# Altium schematic sheet Sheet.schdoc (part 2 of 2)
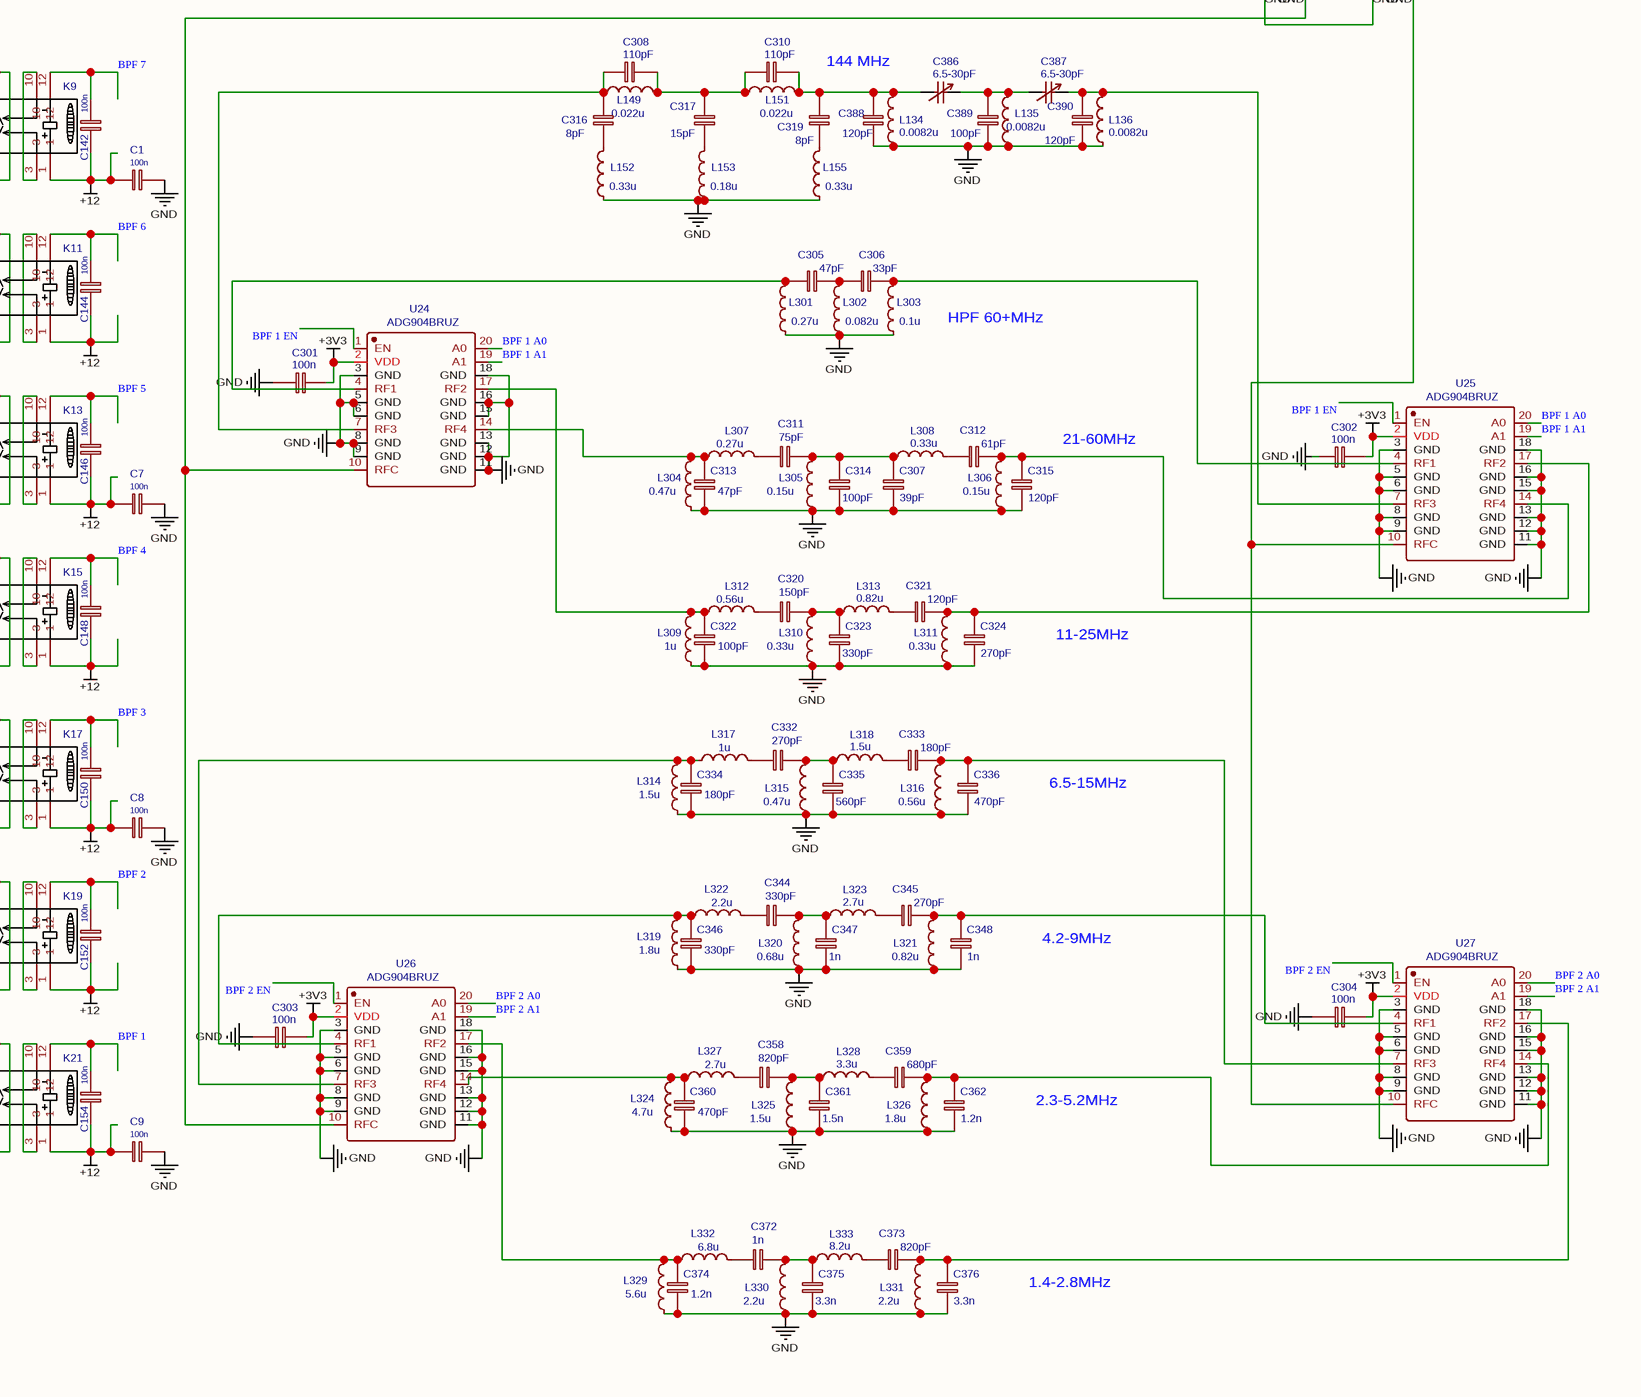
[diagram p6: Sheet.schdoc, bottom right]

## Library data of the parts
C1 C7-C11 C16 C38 C58 C59 C61 C64 C67 C71 C76 C78 C80 C82 C89 C90 C106-C110 C113 C114 C116-C118 C123 C124 C130 C131 C133 C136 C137 C141-C154 C157-C167 C170 C171 C241 C301-C304 = 100n: nameAlias: Value(F); Contributor: LCEDA_Lib; spicePre: C
  C1 C7-C11 C16 C38 C59 C64 C67 C71 C76 C78 C80 C82 C89 C90 C107-C110 C113 C114 C116-C118 C123 C124 C130 C131 C133 C136 C137 C141-C154 C157-C167 C170 C171 C241 C301-C304: spiceSymbolName: C_0805_EU
  C58 C61 C106: spiceSymbolName: C_1206_EU
C2 C3 = 2pF: nameAlias: Value(F); Contributor: LCEDA_Lib; spicePre: C; spiceSymbolName: C_1206_EU
C4-C6 = 5pF: nameAlias: Value(F); Contributor: LCEDA_Lib; spicePre: C; spiceSymbolName: C_1206_EU
C12 C15 = 15+10pF: nameAlias: Value(F); Contributor: LCEDA_Lib; spicePre: C; spiceSymbolName: C_1206_EU
C13 = 10+10pF: nameAlias: Value(F); Contributor: LCEDA_Lib; spicePre: C; spiceSymbolName: C_1206_EU
C14 C17 C19 C20 C72 C87 C91 C93 C103 C314 C322 C389 = 100pF: nameAlias: Value(F); Contributor: LCEDA_Lib; spicePre: C
  C14 C17 C19 C20 C87 C91 C93 C103: spiceSymbolName: C_1206_EU
  C72 C314 C322 C389: spiceSymbolName: C_0805_EU
C18 = 100+22pF: nameAlias: Value(F); Contributor: LCEDA_Lib; spicePre: C; spiceSymbolName: C_1206_EU
C22 C25 C28 C320 = 150pF: nameAlias: Value(F); Contributor: LCEDA_Lib; spicePre: C
  C22 C25 C28: spiceSymbolName: C_1206_EU
  C320: spiceSymbolName: C_0805_EU
C23 C86 C305 C313 = 47pF: nameAlias: Value(F); Contributor: LCEDA_Lib; spicePre: C
  C23 C86: spiceSymbolName: C_1206_EU
  C305 C313: spiceSymbolName: C_0805_EU
C24 C27 C30 C88 = 220pF: nameAlias: Value(F); Contributor: LCEDA_Lib; spicePre: C; spiceSymbolName: C_1206_EU
C29 C323 C344 C346 = 330pF: nameAlias: Value(F); Contributor: LCEDA_Lib; spicePre: C
  C29: spiceSymbolName: C_1206_EU
  C323 C344 C346: spiceSymbolName: C_0805_EU
C32-C35 C336 C360 = 470pF: nameAlias: Value(F); Contributor: LCEDA_Lib; spicePre: C
  C32-C35: spiceSymbolName: C_1206_EU
  C336 C360: spiceSymbolName: C_0805_EU
C37 C41 = 470+330pF: nameAlias: Value(F); Contributor: LCEDA_Lib; spicePre: C; spiceSymbolName: C_1206_EU
C39 C45 = 1000pF: nameAlias: Value(F); Contributor: LCEDA_Lib; spicePre: C; spiceSymbolName: C_1206_EU
C40 C335 = 560pF: nameAlias: Value(F); Contributor: LCEDA_Lib; spicePre: C
  C40: spiceSymbolName: C_1206_EU
  C335: spiceSymbolName: C_0805_EU
C43 C46 = 1000+220pF: nameAlias: Value(F); Contributor: LCEDA_Lib; spicePre: C; spiceSymbolName: C_1206_EU
C44 = 1000+470pF: nameAlias: Value(F); Contributor: LCEDA_Lib; spicePre: C; spiceSymbolName: C_1206_EU
C52 C56 = 100pF 500V: nameAlias: Value(F); Contributor: LCEDA_Lib; spicePre: C; spiceSymbolName: C_1206_EU
C53 C54 C70 C75 = 4.7n: nameAlias: Value(F); Contributor: LCEDA_Lib; spicePre: C
  C53 C54: spiceSymbolName: C_1206_EU
  C70 C75: spiceSymbolName: C_0805_EU
C55 = 27pF: nameAlias: Value(F); Contributor: LCEDA_Lib; spicePre: C; spiceSymbolName: C_0805_EU
C57 = 1.2n 500V: nameAlias: Value(F); Contributor: LCEDA_Lib; spicePre: C; spiceSymbolName: C_1206_EU
C60 = 200p 500V: nameAlias: Value(F); Contributor: LCEDA_Lib; spicePre: C; spiceSymbolName: C_1206_EU
C62 C63 C79 C83 C126 C128 = 1uF: nameAlias: Value(F); Contributor: LCEDA_Lib; spicePre: C; spiceSymbolName: C_0805_EU
C65 C66 C386 C387 = 6.5-30pF: BOM_Manufacturer: Murata Electronics; BOM_Manufacturer Part: TZC3P300A110R00; nameAlias: Value; Contributor: LCSC; BOM_Supplier: LCSC; BOM_Supplier Part: C107707; spicePre: C; spiceSymbolName: TZC3P300A110R00
C68 C73 C315 C321 C388 C390 = 120pF: nameAlias: Value(F); Contributor: LCEDA_Lib; spicePre: C; spiceSymbolName: C_0805_EU
C69 C92 C102 C121 = 10n: nameAlias: Value(F); Contributor: LCEDA_Lib; spicePre: C
  C69 C121: spiceSymbolName: C_0805_EU
  C92 C102: spiceSymbolName: C_1206_EU
C74 C77 = 22uF: nameAlias: Value(F); Contributor: EasyEDA; spicePre: C; spiceSymbolName: Cap_Tantalum(SMD)_B-3528_EU
C81 C111 = 15n: nameAlias: Value(F); Contributor: LCEDA_Lib; spicePre: C; spiceSymbolName: C_1206_EU
C84 = 10pF: nameAlias: Value(F); Contributor: LCEDA_Lib; spicePre: C; spiceSymbolName: C_1206_EU
C85 = 22pF: nameAlias: Value(F); Contributor: LCEDA_Lib; spicePre: C; spiceSymbolName: C_1206_EU
C94 C104 C112 C115 C120 C122 C347 C348 C372 = 1n: nameAlias: Value(F); Contributor: LCEDA_Lib; spicePre: C
  C94 C104: spiceSymbolName: C_1206_EU
  C112 C115 C120 C122 C347 C348 C372: spiceSymbolName: C_0805_EU
C95 = 2.2uF: nameAlias: Value(F); Contributor: LCEDA_Lib; spicePre: C; spiceSymbolName: C_1206_EU
C96-C100 = *: BOM_Manufacturer: TDK; BOM_Manufacturer Part: CC45SL3AD101JYSNA; Contributor: LCSC; BOM_Supplier: LCSC; BOM_Supplier Part: C2835349; spicePre: C; spiceSymbolName: CC45SL3AD101JYSNA
C101 = 200pF: nameAlias: Value(F); Contributor: LCEDA_Lib; spicePre: C; spiceSymbolName: C_1206_EU
C105 = 1n8: nameAlias: Value(F); Contributor: LCEDA_Lib; spicePre: C; spiceSymbolName: C_1206_EU
C119 = 47uF: nameAlias: Value(F); Contributor: EasyEDA; spicePre: C; spiceSymbolName: Cap_Tantalum(SMD)_B-3528_EU
C127 C132 = 100p: nameAlias: Value(F); Contributor: LCEDA_Lib; spicePre: C; spiceSymbolName: C_0805_EU
C129 = 10uF 25V: nameAlias: Value(F); Contributor: LCEDA_Lib; spicePre: C; spiceSymbolName: CE_SMD_D4.0×H5.5_EU
C201 = 39p: nameAlias: Value(F); Contributor: LCEDA_Lib; spicePre: C; spiceSymbolName: C_0805_EU
C202 C208 = 68p: nameAlias: Value(F); Contributor: LCEDA_Lib; spicePre: C; spiceSymbolName: C_0805_EU
C203 = 12p: nameAlias: Value(F); Contributor: LCEDA_Lib; spicePre: C; spiceSymbolName: C_0805_EU
C204 = 27p: nameAlias: Value(F); Contributor: LCEDA_Lib; spicePre: C; spiceSymbolName: C_0805_EU
C207 = 51p: nameAlias: Value(F); Contributor: LCEDA_Lib; spicePre: C; spiceSymbolName: C_0805_EU
C210 = 47p: nameAlias: Value(F); Contributor: LCEDA_Lib; spicePre: C; spiceSymbolName: C_0805_EU
C306 = 33pF: nameAlias: Value(F); Contributor: LCEDA_Lib; spicePre: C; spiceSymbolName: C_0805_EU
C307 = 39pF: nameAlias: Value(F); Contributor: LCEDA_Lib; spicePre: C; spiceSymbolName: C_0805_EU
C308 C310 = 110pF: nameAlias: Value(F); Contributor: LCEDA_Lib; spicePre: C; spiceSymbolName: C_0805_EU
C311 = 75pF: nameAlias: Value(F); Contributor: LCEDA_Lib; spicePre: C; spiceSymbolName: C_0805_EU
C312 = 61pF: nameAlias: Value(F); Contributor: LCEDA_Lib; spicePre: C; spiceSymbolName: C_0805_EU
C316 C319 = 8pF: nameAlias: Value(F); Contributor: LCEDA_Lib; spicePre: C; spiceSymbolName: C_0805_EU
C317 = 15pF: nameAlias: Value(F); Contributor: LCEDA_Lib; spicePre: C; spiceSymbolName: C_0805_EU
C324 C332 C345 = 270pF: nameAlias: Value(F); Contributor: LCEDA_Lib; spicePre: C; spiceSymbolName: C_0805_EU
C333 C334 = 180pF: nameAlias: Value(F); Contributor: LCEDA_Lib; spicePre: C; spiceSymbolName: C_0805_EU
C358 C373 = 820pF: nameAlias: Value(F); Contributor: LCEDA_Lib; spicePre: C; spiceSymbolName: C_0805_EU
C359 = 680pF: nameAlias: Value(F); Contributor: LCEDA_Lib; spicePre: C; spiceSymbolName: C_0805_EU
C361 = 1.5n: nameAlias: Value(F); Contributor: LCEDA_Lib; spicePre: C; spiceSymbolName: C_0805_EU
C362 C374 = 1.2n: nameAlias: Value(F); Contributor: LCEDA_Lib; spicePre: C; spiceSymbolName: C_0805_EU
C375 C376 = 3.3n: nameAlias: Value(F); Contributor: LCEDA_Lib; spicePre: C; spiceSymbolName: C_0805_EU
D1 D3 D49 D50 = BAT46JFILM: BOM_Manufacturer: STMicroelectronics; Contributor: LCSC; BOM_Supplier: LCSC; BOM_Supplier Part: C111205; BOM_Manufacturer Part: BAT46JFILM; BOM_JLCPCB Part Class: Extended Part; spicePre: D; spiceSymbolName: BAT46JFILM
D2 = SMAJ5.0A-TR: BOM_Manufacturer: STMicroelectronics; Contributor: LCSC; BOM_Supplier: LCSC; BOM_Supplier Part: C98802; BOM_Manufacturer Part: SMAJ5.0A-TR; BOM_JLCPCB Part Class: Extended Part; spicePre: D; spiceSymbolName: SMAJ5.0A-TR
D4 D5 D8 D9 D13 D15 D17 D20 D22 D25 D27 D31 D32 D38-D48 D51 = 1N4148W: BOM_Manufacturer: Tak Cheong; Contributor: LCEDA_Lib; BOM_Supplier: LCSC; BOM_Manufacturer Part: 1N4148W; BOM_Supplier Part: C129216; spicePre: D; spiceSymbolName: 1N4148W
D7 = BAV99: BOM_Manufacturer: DIODES; BOM_Manufacturer Part: BAV99-7-F; BOM_Supplier: LCSC; BOM_Supplier Part: C106919; BOM_JLCPCB Part Class: Extended Part; spicePre: D; spiceSymbolName: BAV99-7-F
D18 D23 D35-D37 = SS14: BOM_Manufacturer: MDD; BOM_Supplier: LCSC; BOM_Manufacturer Part: SS14; BOM_Supplier Part: C2480; BOM_JLCPCB Part Class: Basic Part; spicePre: D; spiceSymbolName: SS14
FB1 FB2 = BLM21: Contributor: Tommy H; spicePre: L; spiceSymbolName: IND_FERRITE_BEAD
H1 = FAN_OUT: Contributor: LCEDA_Lib; BOM_Supplier Part: C49661; BOM_Supplier: LCSC; spicePre: H; spiceSymbolName: HDR-F-2.54_1x2
J1 = ANT1: BOM_Manufacturer: DreamLNK; BOM_Manufacturer Part: SMA-KE-P901; Contributor: LCSC; BOM_Supplier: LCSC; BOM_Supplier Part: C914556; BOM_JLCPCB Part Class: Extended Part; spicePre: R; spiceSymbolName: SMA-KE-P901
J2 = ADC: BOM_Manufacturer: DreamLNK; BOM_Manufacturer Part: SMA-KE-P901; Contributor: LCSC; BOM_Supplier: LCSC; BOM_Supplier Part: C914556; BOM_JLCPCB Part Class: Extended Part; spicePre: R; spiceSymbolName: SMA-KE-P901
J3 = EXTERNAL: description: HARTING; timeStamp: 1471955319; spicePre: C; spiceSymbolName: IDC10
J4 = MOTHERBOARD: description: HARTING; timeStamp: 1471955319; spicePre: C; spiceSymbolName: IDC10
J5 = ANT2: BOM_Manufacturer: DreamLNK; BOM_Manufacturer Part: SMA-KE-P901; Contributor: LCSC; BOM_Supplier: LCSC; BOM_Supplier Part: C914556; BOM_JLCPCB Part Class: Extended Part; spicePre: R; spiceSymbolName: SMA-KE-P901
J6 = HiCurrent 13.8V: BOM_Manufacturer: Toponelec(拓宜); BOM_Manufacturer Part: TY500-5.08-02P-14-00AH; Contributor: LCSC; BOM_Supplier: LCSC; BOM_Supplier Part: C2828268; BOM_JLCPCB Part Class: Extended Part; spicePre: C; spiceSymbolName: TY500-5.08-02P-14-00AH
J7 = HiCurrent13.8V: BOM_Manufacturer: Toponelec(拓宜); BOM_Manufacturer Part: TY500-5.08-02P-14-00AH; Contributor: LCSC; BOM_Supplier: LCSC; BOM_Supplier Part: C2828268; BOM_JLCPCB Part Class: Extended Part; spicePre: C; spiceSymbolName: TY500-5.08-02P-14-00AH
J8 = 13.8V: BOM_Manufacturer: Toponelec(拓宜); BOM_Manufacturer Part: TY500-5.08-02P-14-00AH; Contributor: LCSC; BOM_Supplier: LCSC; BOM_Supplier Part: C2828268; BOM_JLCPCB Part Class: Extended Part; spicePre: C; spiceSymbolName: TY500-5.08-02P-14-00AH
J9 = DAC: BOM_Manufacturer: DreamLNK; BOM_Manufacturer Part: SMA-KE-P901; Contributor: LCSC; Package Display: No; BOM_Supplier: LCSC; BOM_Supplier Part: C914556; BOM_JLCPCB Part Class: Extended Part; spicePre: R; spiceSymbolName: SMA-KE-P901
K1 K2 K4 K8-K21 K24-K35 = G6S-2-12V: BOM_Manufacturer: OMRON; BOM_Supplier: LCSC; BOM_Manufacturer Part: G6S-2-12V; BOM_Supplier Part: C28410; BOM_JLCPCB Part Class: Extended Part; spicePre: K; spiceSymbolName: G6S-2-12V
K50 = G6K-2F-5V: BOM_Manufacturer: Omron Electronics; Contributor: LCSC; BOM_Supplier: LCSC; BOM_Supplier Part: C231389; BOM_Manufacturer Part: -; spicePre: K; spiceSymbolName: G6K-2F-Y DC5
L1-L3 = 0.2uH: BOM_Manufacturer: China; BOM_Manufacturer Part: BL02RN2R1M2; nameAlias: Value(H); Value: 7A; Contributor: Константин Сергеевич; BOM_Supplier Part: C84974; spicePre: L; spiceSymbolName: T68-2 Iron Powder Toroidal Inductor
L7 L8 = 0.065uH: BOM_Manufacturer: China; BOM_Manufacturer Part: BL02RN2R1M2; nameAlias: Value(H); Value: 7A; Contributor: Константин Сергеевич; BOM_Supplier Part: C84974; spicePre: L; spiceSymbolName: T68-2 Iron Powder Toroidal Inductor
L10 L11 = 0.15uH: BOM_Manufacturer: China; BOM_Manufacturer Part: BL02RN2R1M2; nameAlias: Value(H); Value: 7A; Contributor: Константин Сергеевич; BOM_Supplier Part: C84974; spicePre: L; spiceSymbolName: T68-2 Iron Powder Toroidal Inductor
L13 L14 = 0.3uH: BOM_Manufacturer: China; BOM_Manufacturer Part: BL02RN2R1M2; nameAlias: Value(H); Value: 7A; Contributor: Константин Сергеевич; BOM_Supplier Part: C84974; spicePre: L; spiceSymbolName: T68-2 Iron Powder Toroidal Inductor
L16 L17 = 0.6uH: BOM_Manufacturer: China; BOM_Manufacturer Part: BL02RN2R1M2; nameAlias: Value(H); Value: 7A; Contributor: Константин Сергеевич; BOM_Supplier Part: C84974; spicePre: L; spiceSymbolName: T68-2 Iron Powder Toroidal Inductor
L19 L20 = 1.15uH: BOM_Manufacturer: China; BOM_Manufacturer Part: BL02RN2R1M2; nameAlias: Value(H); Value: 7A; Contributor: Константин Сергеевич; BOM_Supplier Part: C84974; spicePre: L; spiceSymbolName: T68-2 Iron Powder Toroidal Inductor
L22 L23 = 2.3uH: BOM_Manufacturer: China; BOM_Manufacturer Part: BL02RN2R1M2; nameAlias: Value(H); Value: 7A; Contributor: Константин Сергеевич; BOM_Supplier Part: C84974; spicePre: L; spiceSymbolName: T68-2 Iron Powder Toroidal Inductor
L25 L26 = 4.5uH: BOM_Manufacturer: China; BOM_Manufacturer Part: BL02RN2R1M2; nameAlias: Value(H); Value: 7A; Contributor: Константин Сергеевич; BOM_Supplier Part: C84974; spicePre: L; spiceSymbolName: T68-2 Iron Powder Toroidal Inductor
L30 L43 = 10u 10x10: Contributor: Esteban Benito; spicePre: L; spiceSymbolName: IND_FERRITE_CORE
L31 L46 = 0.22u: nameAlias: Value(H); Contributor: LCEDA_Lib; spicePre: L; spiceSymbolName: L0805_US
L32-L34 = 0.0082u: nameAlias: Value(H); Contributor: LCEDA_Lib; spicePre: L; spiceSymbolName: L0805_US
L35 = 0.1uH: BOM_Manufacturer: China; BOM_Manufacturer Part: BL02RN2R1M2; nameAlias: Value(H); Value: 7A; Contributor: Константин Сергеевич; BOM_Supplier Part: C84974; spicePre: L; spiceSymbolName: T68-2 Iron Powder Toroidal Inductor
L36 = 0.22uH: BOM_Manufacturer: China; BOM_Manufacturer Part: BL02RN2R1M2; nameAlias: Value(H); Value: 7A; Contributor: Константин Сергеевич; BOM_Supplier Part: C84974; spicePre: L; spiceSymbolName: T68-2 Iron Powder Toroidal Inductor
L39 = 0.45uH: BOM_Manufacturer: China; BOM_Manufacturer Part: BL02RN2R1M2; nameAlias: Value(H); Value: 7A; Contributor: Константин Сергеевич; BOM_Supplier Part: C84974; spicePre: L; spiceSymbolName: T68-2 Iron Powder Toroidal Inductor
L41 = 1.0uH: BOM_Manufacturer: China; BOM_Manufacturer Part: BL02RN2R1M2; nameAlias: Value(H); Value: 7A; Contributor: Константин Сергеевич; BOM_Supplier Part: C84974; spicePre: L; spiceSymbolName: T68-2 Iron Powder Toroidal Inductor
L42 = 2.2uH: BOM_Manufacturer: China; BOM_Manufacturer Part: BL02RN2R1M2; nameAlias: Value(H); Value: 7A; Contributor: Константин Сергеевич; BOM_Supplier Part: C84974; spicePre: L; spiceSymbolName: T68-2 Iron Powder Toroidal Inductor
L48 = 0.022u: nameAlias: Value(H); Contributor: LCEDA_Lib; spicePre: L; spiceSymbolName: L0805_US
L134-L136 = 0.0082u: BOM_Manufacturer: KEMET; BOM_Manufacturer Part: L0805C100MDWIT; Contributor: Константин Тищенко; BOM_Supplier: LCSC; BOM_Supplier Part: C696787; spicePre: L; spiceSymbolName: L0805-WOLF
L140 = 0.1u: nameAlias: Value(H); Contributor: LCEDA_Lib; spicePre: L; spiceSymbolName: L0805_US
L141 = 0.082u: nameAlias: Value(H); Contributor: LCEDA_Lib; spicePre: L; spiceSymbolName: L0805_US
L142 = 0.15u: nameAlias: Value(H); Contributor: LCEDA_Lib; spicePre: L; spiceSymbolName: L0805_US
L149 L151 = 0.022u: BOM_Manufacturer: KEMET; BOM_Manufacturer Part: L0805C100MDWIT; Contributor: Константин Тищенко; BOM_Supplier: LCSC; BOM_Supplier Part: C696787; spicePre: L; spiceSymbolName: L0805-WOLF
L152 L155 L308 L310 L311 = 0.33u: BOM_Manufacturer: KEMET; BOM_Manufacturer Part: L0805C100MDWIT; Contributor: Константин Тищенко; BOM_Supplier: LCSC; BOM_Supplier Part: C696787; spicePre: L; spiceSymbolName: L0805-WOLF
L153 = 0.18u: BOM_Manufacturer: KEMET; BOM_Manufacturer Part: L0805C100MDWIT; Contributor: Константин Тищенко; BOM_Supplier: LCSC; BOM_Supplier Part: C696787; spicePre: L; spiceSymbolName: L0805-WOLF
L301 L307 = 0.27u: BOM_Manufacturer: KEMET; BOM_Manufacturer Part: L0805C100MDWIT; Contributor: Константин Тищенко; BOM_Supplier: LCSC; BOM_Supplier Part: C696787; spicePre: L; spiceSymbolName: L0805-WOLF
L302 = 0.082u: BOM_Manufacturer: KEMET; BOM_Manufacturer Part: L0805C100MDWIT; Contributor: Константин Тищенко; BOM_Supplier: LCSC; BOM_Supplier Part: C696787; spicePre: L; spiceSymbolName: L0805-WOLF
L303 = 0.1u: BOM_Manufacturer: KEMET; BOM_Manufacturer Part: L0805C100MDWIT; Contributor: Константин Тищенко; BOM_Supplier: LCSC; BOM_Supplier Part: C696787; spicePre: L; spiceSymbolName: L0805-WOLF
L304 L315 = 0.47u: BOM_Manufacturer: KEMET; BOM_Manufacturer Part: L0805C100MDWIT; Contributor: Константин Тищенко; BOM_Supplier: LCSC; BOM_Supplier Part: C696787; spicePre: L; spiceSymbolName: L0805-WOLF
L305 L306 = 0.15u: BOM_Manufacturer: KEMET; BOM_Manufacturer Part: L0805C100MDWIT; Contributor: Константин Тищенко; BOM_Supplier: LCSC; BOM_Supplier Part: C696787; spicePre: L; spiceSymbolName: L0805-WOLF
L309 L317 = 1u: BOM_Manufacturer: KEMET; BOM_Manufacturer Part: L0805C100MDWIT; Contributor: Константин Тищенко; BOM_Supplier: LCSC; BOM_Supplier Part: C696787; spicePre: L; spiceSymbolName: L0805-WOLF
L312 L316 = 0.56u: BOM_Manufacturer: KEMET; BOM_Manufacturer Part: L0805C100MDWIT; Contributor: Константин Тищенко; BOM_Supplier: LCSC; BOM_Supplier Part: C696787; spicePre: L; spiceSymbolName: L0805-WOLF
L313 L321 = 0.82u: BOM_Manufacturer: KEMET; BOM_Manufacturer Part: L0805C100MDWIT; Contributor: Константин Тищенко; BOM_Supplier: LCSC; BOM_Supplier Part: C696787; spicePre: L; spiceSymbolName: L0805-WOLF
L314 L318 L325 = 1.5u: BOM_Manufacturer: KEMET; BOM_Manufacturer Part: L0805C100MDWIT; Contributor: Константин Тищенко; BOM_Supplier: LCSC; BOM_Supplier Part: C696787; spicePre: L; spiceSymbolName: L0805-WOLF
L319 L326 = 1.8u: BOM_Manufacturer: KEMET; BOM_Manufacturer Part: L0805C100MDWIT; Contributor: Константин Тищенко; BOM_Supplier: LCSC; BOM_Supplier Part: C696787; spicePre: L; spiceSymbolName: L0805-WOLF
L320 = 0.68u: BOM_Manufacturer: KEMET; BOM_Manufacturer Part: L0805C100MDWIT; Contributor: Константин Тищенко; BOM_Supplier: LCSC; BOM_Supplier Part: C696787; spicePre: L; spiceSymbolName: L0805-WOLF
L322 L330 L331 = 2.2u: BOM_Manufacturer: KEMET; BOM_Manufacturer Part: L0805C100MDWIT; Contributor: Константин Тищенко; BOM_Supplier: LCSC; BOM_Supplier Part: C696787; spicePre: L; spiceSymbolName: L0805-WOLF
L323 L327 = 2.7u: BOM_Manufacturer: KEMET; BOM_Manufacturer Part: L0805C100MDWIT; Contributor: Константин Тищенко; BOM_Supplier: LCSC; BOM_Supplier Part: C696787; spicePre: L; spiceSymbolName: L0805-WOLF
L324 = 4.7u: BOM_Manufacturer: KEMET; BOM_Manufacturer Part: L0805C100MDWIT; Contributor: Константин Тищенко; BOM_Supplier: LCSC; BOM_Supplier Part: C696787; spicePre: L; spiceSymbolName: L0805-WOLF
L328 = 3.3u: BOM_Manufacturer: KEMET; BOM_Manufacturer Part: L0805C100MDWIT; Contributor: Константин Тищенко; BOM_Supplier: LCSC; BOM_Supplier Part: C696787; spicePre: L; spiceSymbolName: L0805-WOLF
L329 = 5.6u: BOM_Manufacturer: KEMET; BOM_Manufacturer Part: L0805C100MDWIT; Contributor: Константин Тищенко; BOM_Supplier: LCSC; BOM_Supplier Part: C696787; spicePre: L; spiceSymbolName: L0805-WOLF
L332 = 6.8u: BOM_Manufacturer: KEMET; BOM_Manufacturer Part: L0805C100MDWIT; Contributor: Константин Тищенко; BOM_Supplier: LCSC; BOM_Supplier Part: C696787; spicePre: L; spiceSymbolName: L0805-WOLF
L333 = 8.2u: BOM_Manufacturer: KEMET; BOM_Manufacturer Part: L0805C100MDWIT; Contributor: Константин Тищенко; BOM_Supplier: LCSC; BOM_Supplier Part: C696787; spicePre: L; spiceSymbolName: L0805-WOLF
Q1 Q3 = RD16HHF1: Contributor: Eagle; spicePre: Q; spiceSymbolName: RD16HHF1
Q2 Q7 Q10 = IRLML9301: BOM_Manufacturer: VBsemi Elec; BOM_Manufacturer Part: IRLML9301TR; Contributor: LCSC; BOM_Supplier: LCSC; BOM_Supplier Part: C710004; BOM_JLCPCB Part Class: Extended Part; spicePre: Q; spiceSymbolName: IRLML9301TR
Q4 = PGA103+/SPF5189Z: Contributor: radiofannat; spicePre: I; spiceSymbolName: SPF5189Z
Q5 Q6 = RD100HHF1: Contributor: alexei009; spicePre: U; spiceSymbolName: RD100HHF1
Q8 = RA80H1415M1: Contributor: konster13.84; BOM_Manufacturer Part: RA80H1415M1; spicePre: U; spiceSymbolName: RA80H1415M1
Q9 = RD01MUS1: Contributor: Broadcastshop; spicePre: U; spiceSymbolName: RD01MUS1
Q11 = IRLML9301: BOM_Manufacturer: IR; BOM_Manufacturer Part: IRLML9301TRPBF; Contributor: LCSC; BOM_Supplier: LCSC; BOM_Supplier Part: C82056; BOM_JLCPCB Part Class: Extended Part; spicePre: Q; spiceSymbolName: IRLML9301TRPBF
Q12 = BSS123: BOM_Manufacturer: CJ; BOM_Supplier: LCSC; BOM_Manufacturer Part: BSS123; BOM_Supplier Part: C79015; BOM_JLCPCB Part Class: Extended Part; spicePre: Q; spiceSymbolName: BSS123
R1 R2 = 22 2W: BOM_Manufacturer: Chian Chia Elec; nameAlias: Resistance (Ohms); Contributor: LCSC; BOM_Supplier: LCSC; BOM_Supplier Part: C122207; BOM_Manufacturer Part: -; BOM_JLCPCB Part Class: Extended Part; spicePre: R; spiceSymbolName: RI40-1/2W-240KΩ±2% T
R3 R7-R12 = 560: nameAlias: Value(Ω); Contributor: LCEDA_Lib; spicePre: R; spiceSymbolName: R_0805_EU
R4 R41 R45 R48 R75 = 30k: nameAlias: Value(Ω); Contributor: LCEDA_Lib; spicePre: R; spiceSymbolName: R_0805_EU
R5 R6 R31 R33 R35 R42 R43 R57 R69-R72 R201-R207 = 1k: nameAlias: Value(Ω); Contributor: LCEDA_Lib; spicePre: R; spiceSymbolName: R_0805_EU
R13 = 2k: nameAlias: Value(Ω); Contributor: LCEDA_Lib; spicePre: R; spiceSymbolName: R_0805_EU
R14 = KTY81/120: BOM_Manufacturer: NXP(恩智浦); BOM_Manufacturer Part: KTY81/110,112; Contributor: LCSC; BOM_Supplier: LCSC; BOM_Supplier Part: C1527155; spicePre: U; spiceSymbolName: KTY81/110,112
R15 R16 R26 R27 R44 = 56: nameAlias: Value(Ω); Contributor: LCEDA_Lib; spicePre: R; spiceSymbolName: R_0805_EU
R19 R20 = 10K: BOM_Manufacturer: BOURNS; BOM_Manufacturer Part: 3296W-1-102LF; nameAlias: Resistance (Ohms); Resistance(Ohms): 1K; BOM_Supplier: LCSC; BOM_Supplier Part: C57089; spicePre: R; spiceSymbolName: 3296W-1-102LF
R21 = 750: nameAlias: Value(Ω); Contributor: LCEDA_Lib; spicePre: R; spiceSymbolName: R_0805_EU
R22 = 470: nameAlias: Value(Ω); Contributor: LCEDA_Lib; spicePre: R; spiceSymbolName: R_0805_EU
R23 R61 = 20: nameAlias: Value(Ω); Contributor: LCEDA_Lib; spicePre: R; spiceSymbolName: R_0805_EU
R24 R25 R62 R63 = 300: nameAlias: Value(Ω); Contributor: LCEDA_Lib; spicePre: R; spiceSymbolName: R_0805_EU
R28 R29 R34 R51 = 100: nameAlias: Value(Ω); Contributor: LCEDA_Lib; spicePre: R; spiceSymbolName: R_0805_EU
R30 R40 R46 = 1K: BOM_Manufacturer: BOURNS; BOM_Manufacturer Part: 3296W-1-102LF; nameAlias: Resistance (Ohms); BOM_Supplier: LCSC; BOM_Supplier Part: C57089; Resistance(Ohms): 1K; spicePre: R; spiceSymbolName: 3296W-1-102LF
R32 = 6.8k: nameAlias: Value(Ω); Contributor: LCEDA_Lib; spicePre: R; spiceSymbolName: R_0805_EU
R36 R54 = 510: nameAlias: Value(Ω); Contributor: LCEDA_Lib; spicePre: R; spiceSymbolName: R_1206_EU
R37 = 2.7k: nameAlias: Value(Ω); Contributor: LCEDA_Lib; spicePre: R; spiceSymbolName: R_0805_EU
R38 R47 R74 R76 = 4.7: nameAlias: Value(Ω); Contributor: LCEDA_Lib; spicePre: R; spiceSymbolName: R_0805_EU
R39 = 18: nameAlias: Value(Ω); Contributor: LCEDA_Lib; spicePre: R; spiceSymbolName: R_1206_EU
R49 R50 R65 R67 = 0: nameAlias: Value(Ω); Contributor: LCEDA_Lib; spicePre: R; spiceSymbolName: R_1206_EU
R52 = 200: nameAlias: Value(Ω); Contributor: LCEDA_Lib; spicePre: R; spiceSymbolName: R_0805_EU
R53 = 1.2k: nameAlias: Value(Ω); Contributor: LCEDA_Lib; spicePre: R; spiceSymbolName: R_0805_EU
R55 R56 = 50: nameAlias: Value(Ω); Contributor: LCEDA_Lib; spicePre: R; spiceSymbolName: R_1206_EU
R58 = 620: nameAlias: Value(Ω); Contributor: LCEDA_Lib; spicePre: R; spiceSymbolName: R_0805_EU
R59 R60 = 430: nameAlias: Value(Ω); Contributor: LCEDA_Lib; spicePre: R; spiceSymbolName: R_0805_EU
R64 R68 = 1K: nameAlias: Value(Ω); Contributor: LCEDA_Lib; spicePre: R; spiceSymbolName: R_1206_EU
R66 = 100: BOM_Manufacturer: ReliaPro; BOM_Manufacturer Part: 3362P-1-105; nameAlias: Resistance(Ohms); BOM_Supplier: LCSC; BOM_Supplier Part: C20063; spicePre: R; spiceSymbolName: 3362P-1-105
R73 = 10k: nameAlias: Value(Ω); Contributor: LCEDA_Lib; spicePre: R; spiceSymbolName: R_1206_EU
R77 R78 = 2.2k: nameAlias: Value(Ω); Contributor: LCEDA_Lib; spicePre: R; spiceSymbolName: R_0805_EU
T1 = BN61-002: Contributor: Константин Тищенко; BOM_Manufacturer Part: BN61-002; spicePre: T; spiceSymbolName: BN61-002 Wolf
T2 T3 = BN43-202: Contributor: Константин Тищенко; spicePre: ?
  T2: spiceSymbolName: BN43-202 Wolf
  T3: spiceSymbolName: BN43-202_RD16 Wolf
T5 = 1:1: BOM_Manufacturer: Mini-Circuits; BOM_Manufacturer Part: TC1-1T+; Contributor: LCSC; BOM_Supplier: LCSC; BOM_Supplier Part: C879831; spicePre: U; spiceSymbolName: TC1-1T+
T6 = VHF Tandem Meter: Contributor: konster13.84; BOM_Manufacturer Part: VHF Tandem Meter; spicePre: U; spiceSymbolName: VHF Tandem Meter
TSWR = BN-61-202: BOM_Manufacturer Part: 2843010302; BOM_Manufacturer: Fair-Rite; nameAlias: Value(H); Contributor: LCEDA_Lib; BOM_Supplier Part: 2843010302; spicePre: T; spiceSymbolName: BN-43-303_TANDEM
U1-U3 U7 U11 U21 = STPIC6C595TTR: BOM_Manufacturer: STMicroelectronics; Contributor: LCSC; BOM_Supplier: LCSC; BOM_Supplier Part: C222081; BOM_Manufacturer Part: STPIC6C595TTR; BOM_JLCPCB Part Class: Extended Part; spicePre: U; spiceSymbolName: STPIC6C595TTR
U4 = axicom im06c: Contributor: ys1797; BOM_Manufacturer Part: axicom im06c; BOM_Supplier: axicom; spicePre: U; spiceSymbolName: axicom im06c
U5 U20 = LT1117-ADJ: BOM_Manufacturer: Analog Devices; BOM_Manufacturer Part: LT1117IST#PBF; Contributor: LCSC; BOM_Supplier: LCSC; BOM_Supplier Part: C661269; spicePre: U; spiceSymbolName: LT1117IST#PBF
U6 = LM1117DT-5.0: description: 800mA Low-Dropout Linear Regulator, 3-pin TO-252; spicePre: U; spiceSymbolName: LM1117DT-5.0
U9 = PE4302: BOM_Manufacturer: null; BOM_Manufacturer Part: PE4302-EK; Contributor: LCSC; BOM_Supplier: LCSC; BOM_Supplier Part: C2763949; BOM_JLCPCB Part Class: Extended Part; spicePre: U; spiceSymbolName: PE4302-EK
U12 = axicom im06c: Contributor: ys1797; Package Display: No; BOM_Manufacturer Part: axicom im06c; BOM_Supplier: axicom; spicePre: U; spiceSymbolName: axicom im06c
U13 U14 = ADG918BRMZ: BOM_Manufacturer: Analog Devices; BOM_Manufacturer Part: ADG918BRMZ-500RL7; Contributor: LCSC; BOM_Supplier: LCSC; BOM_Supplier Part: C207406; BOM_JLCPCB Part Class: Extended Part; spicePre: U; spiceSymbolName: ADG918BRMZ-500RL7
U19 = LT1117IST-5.0: BOM_Manufacturer: Analog Devices; BOM_Manufacturer Part: LT1117IST-5#TRPBF; Contributor: LCSC; BOM_Supplier: LCSC; BOM_Supplier Part: C661276; spicePre: U; spiceSymbolName: LT1117IST-5#TRPBF
U24-U27 = ADG904BRUZ: spicePre: X; spiceSymbolName: ADG904BRUZ